# Altium project PI4.PrjPcb
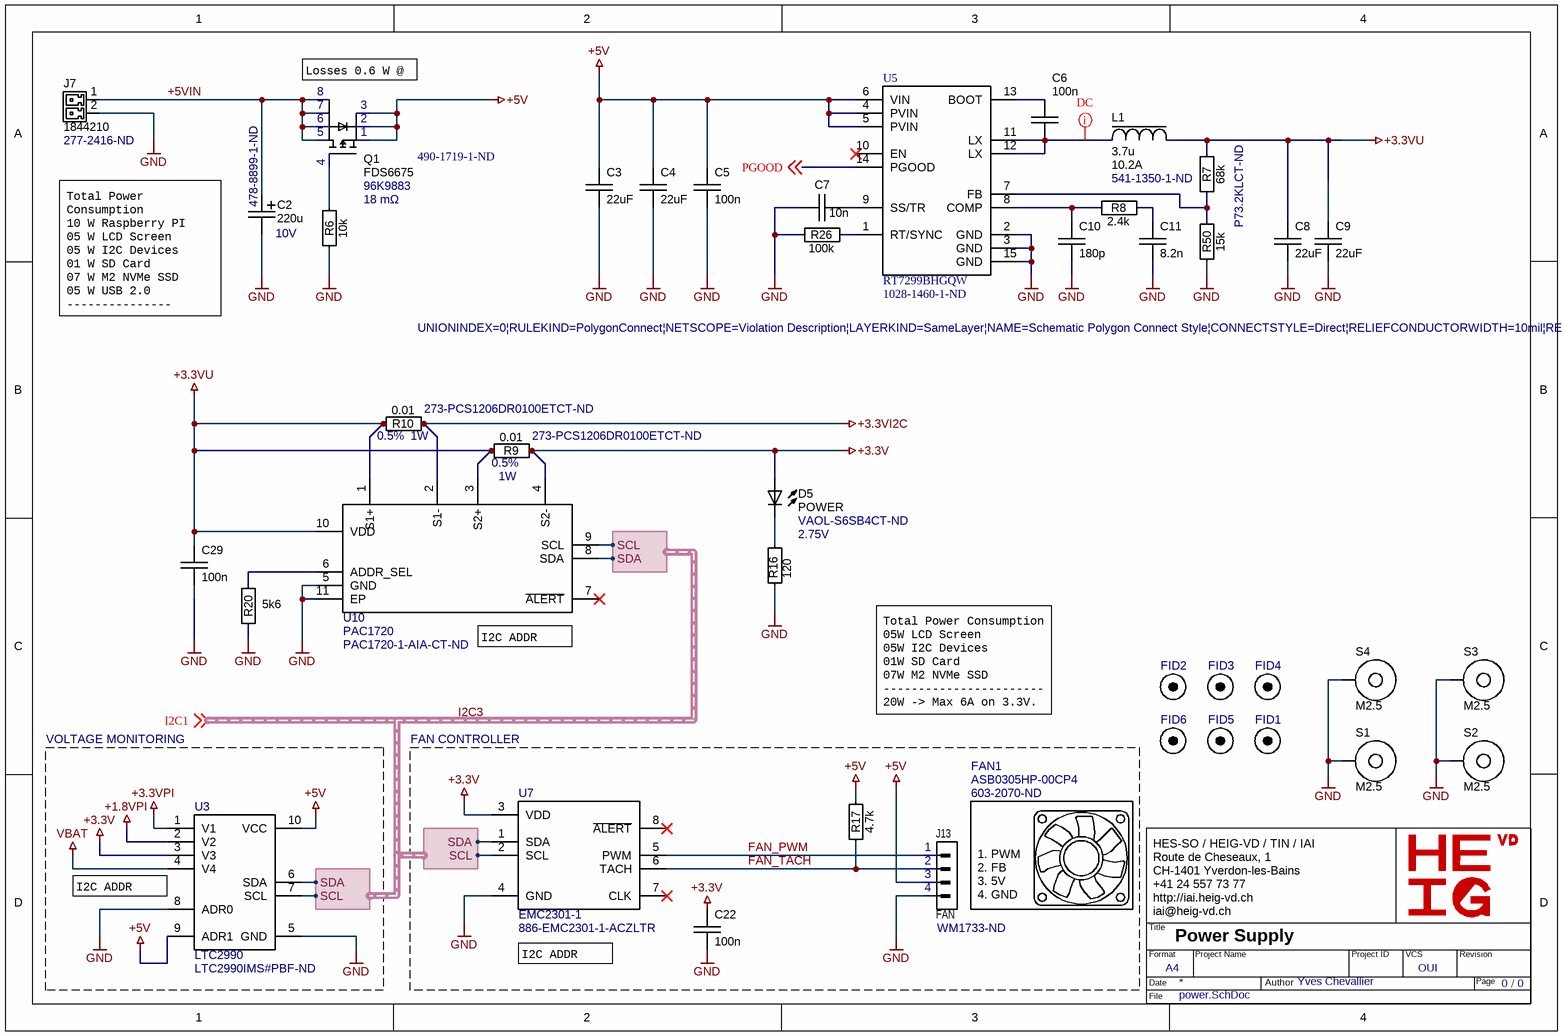
[diagram p0: power.SchDoc]
ProjectAuthor: Yves Chevallier; ProjectiAiTitle: RBT-CM4; ProjectNumber: 1541121; ProjectVersion: 0.1.0
5 sheets, 152 parts. Net scope: global (net labels, ports and power ports of the same name join across sheets).
Board file: pi4.PcbDoc
Sheets:
  power.SchDoc
  gpio.SchDoc
  i2c-can-lin.SchDoc
  usb.SchDoc
  audio.SchDoc

## Sheet power.SchDoc: Power Supply
size A4; ApprovedBy: Yves Chevallier; CheckedBy: Yves Chevallier; Author: Yves Chevallier; CompanyName: EPFL; DrawnBy: Yves Chevallier; Engineer: Yves Chevallier; Organization: EPFL; Address1: EPFL; Address2: CH1015 Lausanne; Address3: +41(0)21 693 36 98; Address4: +41(0)21 693 26 00; DocumentNumber: ABC.00.0000.000.0; Revision: v1.0; SheetNumber: 0; SheetTotal: 0; DrawnByDate: 2000-01-01; ExecutionWarrantDate: 2000-01-01; ExecutionWarrant: Yves Chevallier; Context: Confidential; PageSetup: Record=PageOptions|CenterHorizontal=True|CenterVertical=False|PrintScale=0.97|XCorrection=1.00|YCorrection=1.00|PrintKind=0|BorderSize=5000000|LeftOffset=0|BottomOffset=0|Orientation=2|PaperLength=1000|PaperWidth=1000|Scale=100|PaperSource=262|PrintQuality=600|MediaType=1|DitherType=10|PaperKind=A4|PrintScaleMode=1; EngineerDate: 2000-01-01; CheckedByDate: 2000-01-01; NoProject: 1541121; SVN: OUI; Version: 0.1.0; ProjectTitle: RBT-CM4; ProjectName: PRJ

### Parts
C2  220u  Supplier Part Number 1: 478-8899-1-ND  Voltage: 10V  [CAPPM6032X280N]
C3  22uF  Rule: UNIONINDEX=0|RULEKIND=PolygonConnect|NETSCOPE=Violation Description|LAYERKIND=SameLayer|NAME=Schematic Polygon Connect Style|CONNECTSTYLE=Direct|RELIEFCONDUCTORWIDTH=10mil|RELIEFENTRIES=4|POLYGONRELIEFANGLE=45 Angle|AIRGAPWIDTH=10mil|UNIT=Imperial  Supplier Part Number 1: 490-1719-1-ND  [SM/C1210]
C4  22uF  [SM/C1210]
C5  100n  [SM/C0603]
C6  100n  [SM/C0603]
C7  10n  [SM/C0603]
C8  22uF  [SM/C1210]
C9  22uF  [SM/C1210]
C10  180p  [SM/C0603]
C11  8.2n  [SM/C0603]
C22  100n  [SM/C0603]
C29  100n  [SM/C0603]
D5  POWER  Supplier Part Number 1: VAOL-S6SB4CT-ND  Vf: 2.75V  [SM/LED0603]
FAN1  ASB0305HP-00CP4  Supplier Part Number 1: 603-2070-ND  (mechanical)
FID1  Fiducial 1.5 mm  [FIDUCIAL]  (value not drawn)  (no BOM)
FID2  Fiducial 1.5 mm  [FIDUCIAL]  (value not drawn)  (no BOM)
FID3  Fiducial 1.5 mm  [FIDUCIAL]  (value not drawn)  (no BOM)
FID4  Fiducial 1.5 mm  [FIDUCIAL]  (value not drawn)  (no BOM)
FID5  Fiducial 1.5 mm  [FIDUCIAL]  (value not drawn)  (no BOM)
FID6  Fiducial 1.5 mm  [FIDUCIAL]  (value not drawn)  (no BOM)
J7  1844210  Supplier Part Number 1: 277-2416-ND  [CONN2/PHOENIX/MC 1.5-2-G-3.5]
J13  FAN  [CONN4/MOLEX/1.25mm/53047-0410]
L1  3.7u  Isat: 10.2A  Supplier Part Number 1: 541-1350-1-ND  [IND_IHLP-3232DZ_VIS]
Q1  FDS6675  Supplier Part Number 1: 96K9883  Rdson: 18 mΩ  [SOIC8]
R6  10k  [SM/R0603]
R7  68k  Supplier Part Number 1: P73.2KLCT-ND  [SM/R0603]
R8  2.4k  [SM/R0603]
R9  0.01  Power: 1W  Precision: 0.5%  [SM/R1206]
R10  0.01  Power: 1W  Precision: 0.5%  [SM/R1206]
R16  120  [SM/R0603]
R17  4.7k  [SM/R0603]
R20  5k6  [SM/R0603]
R26  100k  [SM/R0603]
R50  15k  [SM/R0603]
S1  M2.5  [HW/HOLE/M2.5]  (no BOM)
S2  M2.5  [HW/HOLE/M2.5]  (no BOM)
S3  M2.5  [HW/HOLE/M2.5]  (no BOM)
S4  M2.5  [HW/HOLE/M2.5]  (no BOM)
U3  LTC2990  Supplier Part Number 1: LTC2990IMS#PBF-ND  [MSOP10]
U5  RT7299BHGQW  Supplier Part Number 1: 1028-1460-1-ND  [RT7299B]
U7  EMC2301-1  Supplier Part Number 1: 886-EMC2301-1-ACZLTR  [MSOP8]
U10  PAC1720  Supplier Part Number 1: PAC1720-1-AIA-CT-ND  [DFN10_3x3MC_MCH-M]

### Blocks framed on the sheet
VOLTAGE MONITORING: U3
FAN CONTROLLER: C22 FAN1 J13 R17 U7

### Harnesses
I2C: SDA, SCL

### Nets
+1.8VPI: U3.2(V2)
+3.3V: C22.1 D5.1 R9.2 U3.3(V3) U7.3(VDD) U10.4(S2-)
+3.3VI2C: R10.2 U10.2(S1-)
+3.3VPI: U3.1(V1)
+3.3VU: C8.1 C9.1 C29.1 L1.1 R7.1 R9.1 R10.1 U10.1(S1+) U10.3(S2+) U10.10(VDD)
+5V: C3.1 C4.1 C5.1 J13.3 Q1.1(S) Q1.2(S) Q1.3(S) R17.2 U3.9(ADR1) U3.10(VCC) U5.4(PVIN) U5.5(PVIN) U5.6(VIN)
GND: C2.2(-) C3.2 C4.2 C5.2 C7.1 C8.2 C9.2 C10.2 C11.2 C22.2 C29.2 J7.2 J13.4 R6.1 R16.2 R20.1 R26.2 R50.2 S1.1 S2.1 S3.1 S4.1 U3.5(GND) U3.8(ADR0) U5.2(GND) U5.3(GND) U5.15(GND) U7.4(GND) U10.5(GND) U10.11(EP)
VBAT: U3.4(V4)
+5VIN: C2.1(+) J7.1 Q1.5(D) Q1.6(D) Q1.7(D) Q1.8(D)
FAN_PWM: J13.1 U7.5(PWM)
FAN_TACH: J13.2 R17.1 U7.6(TACH)
I2C3.SCL: U3.7(SCL) U7.2(SCL) U10.9(SCL) ; harness I2C.SCL
I2C3.SDA: U3.6(SDA) U7.1(SDA) U10.8(SDA) ; harness I2C.SDA
PGOOD: U5.14(PGOOD) ; off-sheet PGOOD
NetC6_1: C6.1 U5.13(BOOT)
NetC6_2: C6.2 L1.2 U5.11(LX) U5.12(LX)
NetC7_2: C7.2 U5.9(SS/TR)
NetC10_1: C10.1 R8.2 U5.8(COMP)
NetC11_1: C11.1 R8.1
NetD5_2: D5.2 R16.1
NetQ1_4: Q1.4(G) R6.2
NetR7_2: R7.2 R50.1 U5.7(FB)
NetR20_2: R20.2 U10.6(ADDR_SEL)
NetR26_1: R26.1 U5.1(RT/SYNC)

Not connected (* = marked no-connect by the designer): U5 10(EN)*; U7 7(CLK)* 8(~{ALERT})*; U10 7(~{ALERT})*

### Layout directives
rule Polygon Connect Style [Style - Direct Connect]: NetC6_2

### Notes on the sheet
- (near Q1) Losses 0.6 W @ 6A
- (near C2) Total Power Consumption
  10 W Raspberry PI
  05 W LCD Screen
  05 W I2C Devices
  01 W SD Card
  07 W M2 NVMe SSD
  05 W USB 2.0
  ---------------
  30 W -> Max 6A on 5V.
- (near U10) I2C ADDR 0x2c
- Total Power Consumption
  05W LCD Screen
  05W I2C Devices
  01W SD Card
  07W M2 NVMe SSD
  -----------------------
  20W -> Max 6A on 3.3V.
- (near U3) I2C ADDR 0x4e
- (near U7) I2C ADDR 0x2e
- Labels drawn without touching a wire or pin: I2C1
- HES-SO / HEIG-VD / TIN / IAI
  Route de Cheseaux, 1
  CH-1401 Yverdon-les-Bains
  +41 24 557 73 77
  http://iai.heig-vd.ch
  iai@heig-vd.ch
- Title
- Format
- Date
- A4
- Project Name
- Author
- Project ID
- VCS
- Revision
- Page
- /
- File
- (in symbol FAN) 1. PWM; 2. FB; 3. 5V; 4. GND

### Library data of the parts
C2 = C+2312: CAP TANT 220UF 20% 10V 2312; Supplier 1: Digi-Key
C3 = C: CL32B226KPJVPNE; Supplier 1: Digi-Key
C4 C8 C9 = C: CL32B226KPJVPNE; Rule: UNIONINDEX=0|RULEKIND=PolygonConnect|NETSCOPE=Violation Description|LAYERKIND=SameLayer|NAME=Schematic Polygon Connect Style|CONNECTSTYLE=Direct|RELIEFCONDUCTORWIDTH=10mil|RELIEFENTRIES=4|POLYGONRELIEFANGLE=45 Angle|AIRGAPWIDTH=10mil|UNIT=Imperial; Supplier 1: Digi-Key; Supplier Part Number 1: 490-1719-1-ND
C5 C7 C10 C11 = C: Chip Capacitor; Voltage: 16V; Dielectric: X7R; Rule: UNIONINDEX=0|RULEKIND=PolygonConnect|NETSCOPE=Violation Description|LAYERKIND=SameLayer|NAME=Schematic Polygon Connect Style|CONNECTSTYLE=Direct|RELIEFCONDUCTORWIDTH=10mil|RELIEFENTRIES=4|POLYGONRELIEFANGLE=45 Angle|AIRGAPWIDTH=10mil|UNIT=Imperial; Supplier 1: Digi-Key; Supplier Part Number 1: 490-13243-1-ND; Supplier 2 Part Number: 1292-1393-1-ND; Supplier 2: Digi-Key
C6 C22 C29 = C: Chip Capacitor; Voltage: 16V; Dielectric: X7R; Supplier 2 Part Number: 1292-1393-1-ND; Supplier 2: Digi-Key
D5 = LED: Supplier 1: Digi-Key
FAN1 = FAN: Supplier 1: Digi-Key
FID1-FID6 = FIDUCIAL
J7 = CONN 2 PHOENIX 3.5 mm: TERM BLOCK HDR 2POS 90DEG 3.5MM; Imax: 8A; Supplier 1: Digi-Key
J13 = CONN 4 MALE: WM1733-ND; Supplier 1: Digi-Key; Supplier Part Number 1: WM1733-ND
L1 = L: IHLP3232DZER2R2M11; Value: 2.2uH; Rule: UNIONINDEX=0|RULEKIND=PolygonConnect|NETSCOPE=Violation Description|LAYERKIND=SameLayer|NAME=Schematic Polygon Connect Style|CONNECTSTYLE=Direct|RELIEFCONDUCTORWIDTH=10mil|RELIEFENTRIES=4|POLYGONRELIEFANGLE=45 Angle|AIRGAPWIDTH=10mil|UNIT=Imperial; Supplier 1: Digi-Key
Q1 = NDS9435A: MOSFET P-CH 30V 11A 8SOIC; Supplier 1: Newark
R6 R8 R16 R17 R20 R26 R50 = R: Chip Resistor SMD
R7 = R: RES 73.2 KOHMS 0.1% 0.15W 0603; Supplier 1: Digi-Key
R9 R10 = R: 273-PCS1206DR0100ETCT-ND; Rule: UNIONINDEX=0|RULEKIND=PolygonConnect|NETSCOPE=Violation Description|LAYERKIND=SameLayer|NAME=Schematic Polygon Connect Style|CONNECTSTYLE=Direct|RELIEFCONDUCTORWIDTH=10mil|RELIEFENTRIES=4|POLYGONRELIEFANGLE=45 Angle|AIRGAPWIDTH=10mil|UNIT=Imperial; Supplier 1: Digi-Key; Supplier Part Number 1: 273-PCS1206DR0100ETCT-ND
S1-S4 = HOLE/M2.5
U5 = RT7299B: Buck Switching Regulator IC Positive Adjustable 0.6V 1 Output 8A 14-WFQFN Exposed Pad; Supplier 1: Digi-Key
U7 = EMC2301: IC MOTOR DRIVER 3V-3.6V 8MSOP; Supplier 1: Mouser
U10 = PAC1720: Stromüberwachung Regler Hohe Seite  10-DFN (3x3); Supplier 1: Digi-Key
U3 = LTC2990: Supplier 1: Digi-Key

## Sheet gpio.SchDoc: INTERFACES GPIO
size A4; ApprovedBy: Yves Chevallier; CheckedBy: Yves Chevallier; Author: Yves Chevallier; CompanyName: EPFL; DrawnBy: Yves Chevallier; Engineer: Yves Chevallier; Organization: EPFL; Address1: EPFL; Address2: CH1015 Lausanne; Address3: +41(0)21 693 36 98; Address4: +41(0)21 693 26 00; DocumentNumber: ABC.00.0000.000.0; Revision: v1.0; SheetNumber: 0; SheetTotal: 0; DrawnByDate: 2000-01-01; ExecutionWarrantDate: 2000-01-01; ExecutionWarrant: Yves Chevallier; Context: Confidential; PageSetup: Record=PageOptions|CenterHorizontal=True|CenterVertical=False|PrintScale=0.97|XCorrection=1.00|YCorrection=1.00|PrintKind=0|BorderSize=5000000|LeftOffset=0|BottomOffset=0|Orientation=2|PaperLength=1000|PaperWidth=1000|Scale=100|PaperSource=262|PrintQuality=600|MediaType=1|DitherType=10|PaperKind=A4|PrintScaleMode=1; EngineerDate: 2000-01-01; CheckedByDate: 2000-01-01; NoProject: 1541121; SVN: OUI; Version: 0.1.0; ProjectTitle: RBT-CM4; ProjectName: PRJ
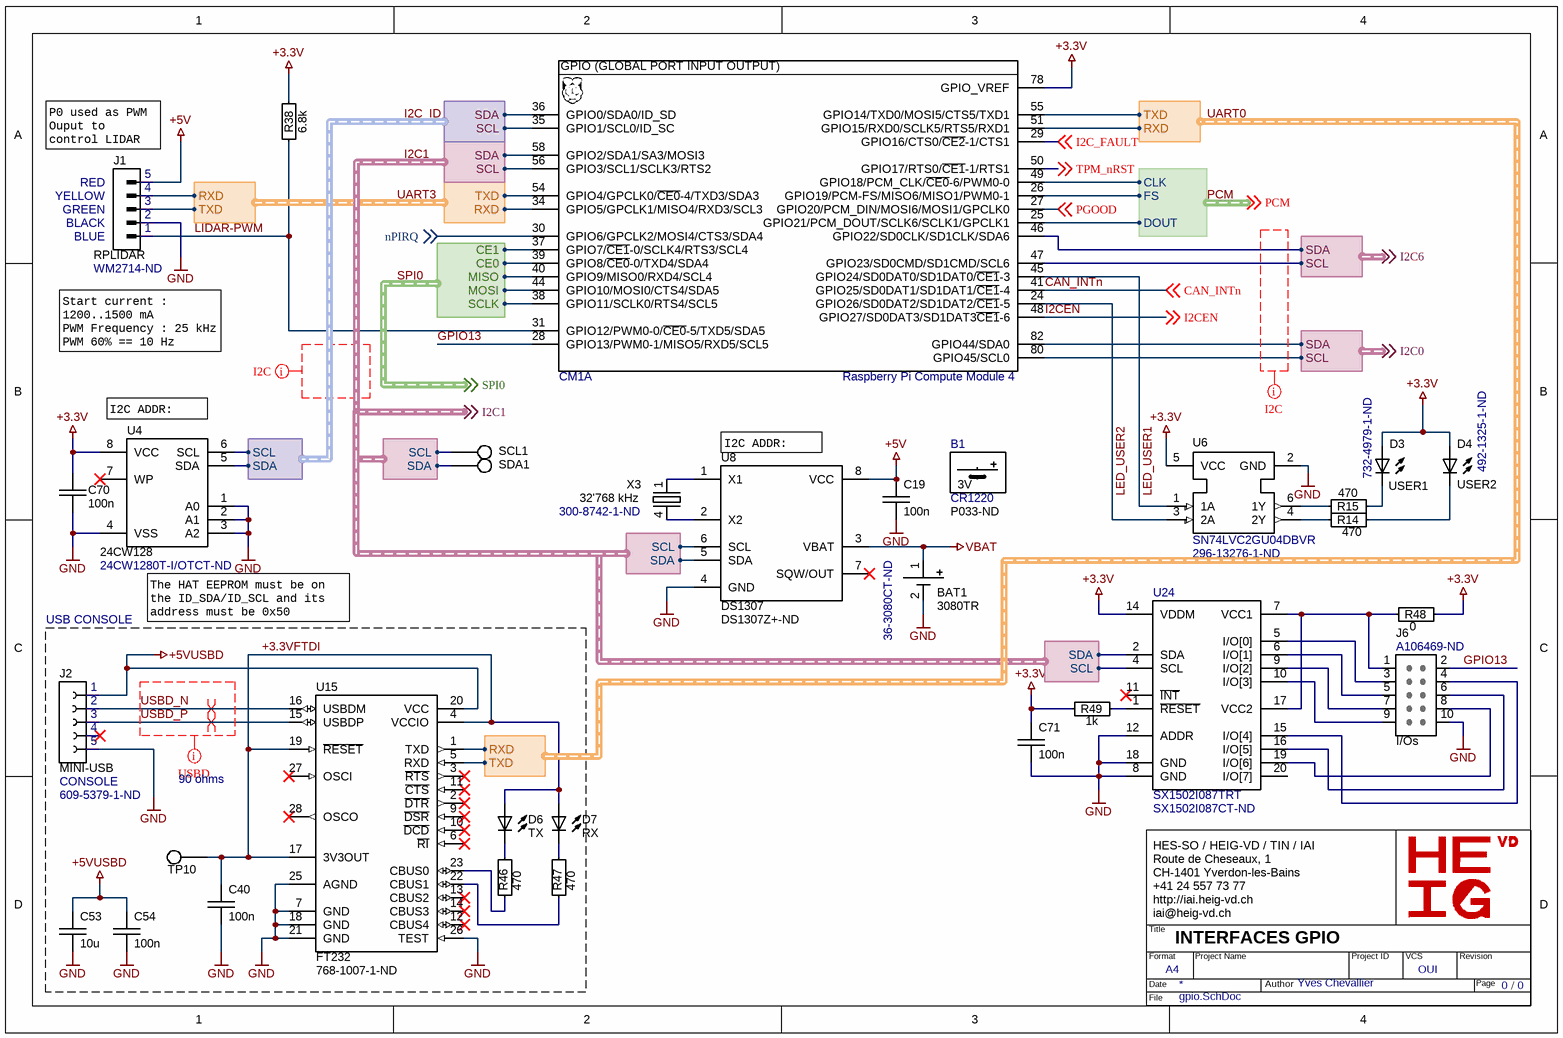
[diagram p1: gpio.SchDoc]

### Parts
(Parts that share a designator on the sheet are numbered #1, #2 ... from top to bottom, then left to right.)
B1  CR1220  Supplier Part Number 1: P033-ND  (mechanical)
BAT1  3080TR  Supplier Part Number 1: 36-3080CT-ND  [BAT_BK-916-TR]
C19  100n  [SM/C0603]
C40  100n  [SM/C0603]
C53  10u  [SM/C0805]
C54  100n  [SM/C0603]
C70  100n  [SM/C0603]
C71  100n  [SM/C0603]
CM1#1  Raspberry Pi Compute Module 4  [CM4-RASPBERRY-PI4]  (part A of 15)
D3  USER1  Supplier Part Number 1: 732-4979-1-ND  [SM/LED0603]
D4  USER2  Supplier Part Number 1: 492-1325-1-ND  [SM/LED0603]
D6  TX  [SM/LED0603]
D7  RX  [SM/LED0603]
J1  RPLIDAR  Supplier Part Number 1: WM2714-ND  [CONN/HEADER/2.54mm/5POS/MOLEX/22122054]
J2  MINI-USB  FUNCTION: CONSOLE  Supplier Part Number 1: 609-5379-1-ND  [AMPHENOL_10118192-0002LF]
J6  I/Os  Supplier Part Number 1: A106469-ND  [HE/2.54/10]
R14  470  [SM/R0603]
R15  470  [SM/R0603]
R38  6.8k  [SM/R0805]
R46  470  [SM/R0805]
R47  470  [SM/R0805]
R48  0  [SM/R0805]
R49  1k  [SM/R0805]
SCL1  TP  [TP/SMALL]  (value not drawn)  (no BOM)
SDA1  TP  [TP/SMALL]  (value not drawn)  (no BOM)
TP10  TP  [TP/SMALL]  (value not drawn)  (no BOM)
U4  24CW128  Supplier Part Number 1: 24CW1280T-I/OTCT-ND  [SOIC8]
U6  SN74LVC2GU04DBVR  Supplier Part Number 1: 296-13276-1-ND  [SOT23-6]
U8  DS1307  Supplier Part Number 1: DS1307Z+-ND  [SOIC8]
U15  FT232  Supplier Part Number 1: 768-1007-1-ND  [SSOP28]
U24  SX1502I087TRT  Supplier Part Number 1: SX1502I087CT-ND  [QFN40P300X300X50_HS-21N]
X3  32'768 kHz  Supplier Part Number 1: 300-8742-1-ND  [CRYSTAL/SMD/ABS25]

### Blocks framed on the sheet
USB CONSOLE: C40 C53 C54 D6 D7 J2 R46 R47 TP10 U15

### Harnesses
I2C: SDA, SCL
UART: TXD, RXD
SPI: CE1, MISO, MOSI, SCLK, CE0
PCM: CLK, FS, DOUT

### Nets
+3.3V: C70.1 C71.1 CM1#1.78(GPIO_VREF) D3.1 D4.1 R38.2 R48.2 R49.1 U4.8(VCC) U6.5(VCC) U24.14(VDDM)
+5V: C19.1 J1.5 U8.8(VCC)
+5VUSBD: C53.1 C54.1 J2.1 U15.20(VCC)
GND: BAT1.2(-) C19.2 C40.2 C53.2 C54.2 C70.2 C71.2 J1.2 J2.5 J6.10 U4.1(A0) U4.2(A1) U4.3(A2) U4.4(VSS) U6.2(GND) U8.4(GND) U15.7(GND) U15.18(GND) U15.21(GND) U15.25(AGND) U15.26(TEST) U24.8(GND) U24.12(ADDR) U24.18(GND)
VBAT: BAT1.1(+) U8.3(VBAT)
+3.3VFTDI: C40.1 D6.1 D7.1 TP10.1 U15.4(VCCIO) U15.17(3V3OUT) U15.19(~{RESET})
CAN_INTn: CM1#1.41(GPIO25/SD0DAT1/SD1DAT1/~{CE1}-4) ; off-sheet CAN_INTn
GPIO13: CM1#1.28(GPIO13/PWM0-1/MISO5/RXD5/SCL5) J6.2
I2C1.SCL: CM1#1.56(GPIO3/SCL1/SCLK3/RTS2) SCL1.1 U8.6(SCL) U24.4(SCL) ; harness I2C.SCL
I2C1.SDA: CM1#1.58(GPIO2/SDA1/SA3/MOSI3) SDA1.1 U8.5(SDA) U24.2(SDA) ; harness I2C.SDA
I2C_FAULT: CM1#1.29(GPIO16/CTS0/~{CE2}-1/CTS1) ; off-sheet I2C_FAULT
I2C_ID.SCL: CM1#1.35(GPIO1/SCL0/ID_SC) U4.6(SCL) ; harness I2C.SCL
I2C_ID.SDA: CM1#1.36(GPIO0/SDA0/ID_SD) U4.5(SDA) ; harness I2C.SDA
I2CEN: CM1#1.48(GPIO27/SD0DAT3/SD1DAT3~{CE1}-6) ; off-sheet I2CEN
LED_USER1: CM1#1.45(GPIO24/SD0DAT0/SD1DAT0/~{CE1}-3) U6.1(1A)
LED_USER2: CM1#1.24(GPIO26/SD0DAT2/SD1DAT2/~{CE1}-5) U6.3(2A)
LIDAR-PWM: CM1#1.31(GPIO12/PWM0-0/~{CE0}-5/TXD5/SDA5) J1.1 R38.1
nPIRQ: CM1#1.30(GPIO6/GPCLK2/MOSI4/CTS3/SDA4) ; off-sheet nPIRQ
PCM.CLK: CM1#1.49(GPIO18/PCM_CLK/~{CE0}-6/PWM0-0) ; harness PCM.CLK
PCM.DOUT: CM1#1.25(GPIO21/PCM_DOUT/SCLK6/SCLK1/GPCLK1) ; harness PCM.DOUT
PCM.FS: CM1#1.26(GPIO19/PCM-FS/MISO6/MISO1/PWM0-1) ; harness PCM.FS
PGOOD: CM1#1.27(GPIO20/PCM_DIN/MOSI6/MOSI1/GPCLK0) ; off-sheet PGOOD
SPI0.CE0: CM1#1.39(GPIO8/~{CE0}-0/TXD4/SDA4) ; harness SPI.CE0
SPI0.CE1: CM1#1.37(GPIO7/~{CE1}-0/SCLK4/RTS3/SCL4) ; harness SPI.CE1
SPI0.MISO: CM1#1.40(GPIO9/MISO0/RXD4/SCL4) ; harness SPI.MISO
SPI0.MOSI: CM1#1.44(GPIO10/MOSI0/CTS4/SDA5) ; harness SPI.MOSI
SPI0.SCLK: CM1#1.38(GPIO11/SCLK0/RTS4/SCL5) ; harness SPI.SCLK
TPM_nRST: CM1#1.50(GPIO17/RTS0/~{CE1}-1/RTS1) ; off-sheet TPM_nRST
UART0.RXD: CM1#1.51(GPIO15/RXD0/SCLK5/RTS5/RXD1) U15.1(TXD) ; harness UART.RXD
UART0.TXD: CM1#1.55(GPIO14/TXD0/MOSI5/CTS5/TXD1) U15.5(RXD) ; harness UART.TXD
UART3.RXD: CM1#1.34(GPIO5/GPCLK1/MISO4/RXD3/SCL3) J1.4 ; harness UART.RXD
UART3.TXD: CM1#1.54(GPIO4/GPCLK0/~{CE0}-4/TXD3/SDA3) J1.3 ; harness UART.TXD
USBD_N: J2.2 U15.16(USBDM)
USBD_P: J2.3 U15.15(USBDP)
NetCM1#1_46: CM1#1.46(GPIO22/SD0CLK/SD1CLK/SDA6) ; harness I2C.SDA
NetCM1#1_47: CM1#1.47(GPIO23/SD0CMD/SD1CMD/SCL6) ; harness I2C.SCL
NetCM1#1_80: CM1#1.80(GPIO45/SCL0) ; harness I2C.SCL
NetCM1#1_82: CM1#1.82(GPIO44/SDA0) ; harness I2C.SDA
NetD3_2: D3.2 R15.2
NetD4_2: D4.2 R14.2
NetD6_2: D6.2 R46.2
NetD7_2: D7.2 R47.2
NetJ6_1: J6.1 R48.1 U24.7(VCC1) U24.17(VCC2)
NetJ6_3: J6.3 U24.5(I/O[0])
NetJ6_4: J6.4 U24.15(I/O[4])
NetJ6_5: J6.5 U24.6(I/O[1])
NetJ6_6: J6.6 U24.16(I/O[5])
NetJ6_7: J6.7 U24.9(I/O[2])
NetJ6_8: J6.8 U24.19(I/O[6])
NetJ6_9: J6.9 U24.10(I/O[3])
NetR14_1: R14.1 U6.4(2Y)
NetR15_1: R15.1 U6.6(1Y)
NetR46_1: R46.1 U15.23(CBUS0)
NetR47_1: R47.1 U15.22(CBUS1)
NetR49_2: R49.2 U24.1(~{RESET})
NetU8_1: U8.1(X1) X3.1
NetU8_2: U8.2(X2) X3.4

Not connected (* = marked no-connect by the designer): J2 4*; U4 7(WP)*; U8 7(SQW/OUT)*; U15 2(~{DTR})* 3(~{RTS})* 6(~{RI})* 9(~{DSR})* 10(~{DCD})* 11(~{CTS})* 12(CBUS4)* 13(CBUS2)* 14(CBUS3)* 27(OSCI)* 28(OSCO)*; U24 11(~{INT})* 20(I/O[7])

### Layout directives
differential pair: USBD_N, USBD_P
rule Impedance Constraint [Min = 85.00    Max = 95.00    ]; Impedance: 90 ohms; rule Differential Pairs Routing [Pref Gap = 6.43mil    Min Gap  = 5.906mil    Max Gap  = 6.43milPref Width = 9.048mil    Min Width  = 5.906mil    Max Width  = 9.048mil]; rule Matched Net Lengths [Tolerance = 10mil]: USBD_N, USBD_P
net class I2C: (no net found under the mark)

### Notes on the sheet
- (near J1) P0 used as PWM Ouput to control LIDAR motor speed
- (near J1) RED
- (near J1) YELLOW
- (near J1) GREEN
- (near J1) BLACK
- (near J1) BLUE
- Start current : 1200..1500 mA
  PWM Frequency : 25 kHz
  PWM 60% == 10 Hz
- (near U4) I2C ADDR: 0x50
- (near U8) I2C ADDR: 0x68
- (near U4) The HAT EEPROM must be on the ID_SDA/ID_SCL and its address must be 0x50
- Labels drawn without touching a wire or pin: I2C0, I2C1, I2C6, PCM, SPI0
- HES-SO / HEIG-VD / TIN / IAI
  Route de Cheseaux, 1
  CH-1401 Yverdon-les-Bains
  +41 24 557 73 77
  http://iai.heig-vd.ch
  iai@heig-vd.ch
- Title
- Format
- Date
- A4
- Project Name
- Author
- Project ID
- VCS
- Revision
- Page
- /
- File
- (in symbol CM4, part A) GPIO (GLOBAL PORT INPUT OUTPUT)
- (in symbol CR1220) 3V

### Library data of the parts
B1 = CR1220: Lithum battery (LiCB) / 3V / 40mAh / 12.5 mm / 0.77 g; Supplier 1: Digi-Key
BAT1 = BAT: Supplier 1: Digi-Key
C19 C40 C54 C70 C71 = C: as C6 on sheet power; Supplier 2 Part Number: 1292-1393-1-ND; Supplier 2: Digi-Key
C53 = C: CAP CER 10UF 10V X5R 0805; Supplier 1: Digi-Key; Supplier Part Number 1: 1276-2402-1-ND
CM1#1 = CM4: Raspberry Pi Compute Module 4 by Amornthep Phunsin
D3 D4 D6 D7 = LED: Supplier 1: Digi-Key
  D6 D7: Supplier Part Number 1: 732-4979-1-ND
J1 = CONN 5 MALE: 0022122054; Supplier 1: Digi-Key
J2 = CONN 5 FEMALE: DEBUG; Supplier 1: Digi-Key
J6 = CONN 10 (2x5): Supplier 1: Digi-Key
R14 R15 R38 R46-R49 = R: Chip Resistor SMD
SCL1 SDA1 TP10 = TP: Test Point
U6 = SN74LVC2GU: IC INVERTER 2CH 2-INP SOT23-6; Supplier 1: Digi-Key
U8 = DS1307: RTC; Supplier 1: Digi-Key
U24 = SX1502I08: IC GPIO EXPANDER I2C 8CH 20QFNI/O Expander 8 I²C 400kHz 20-QFN-UT (3x3); Supplier 1: Digi-Key
X3 = XTAL: CM200C32768HZFT; Supplier 1: Digi-Key
U4 = 24CW128: Supplier 1: Digi-Key
U15 = FT232: Supplier 1: Digi-Key

## Sheet i2c-can-lin.SchDoc: CAN and I2C
size A4; Author: Yves Chevallier; Organization: Institut d'Automatisation Industrielle; NoProject: 1541121; SVN: OUI; Version: 0.1.0; ProjectTitle: RBT-CM4; ProjectName: <projet>
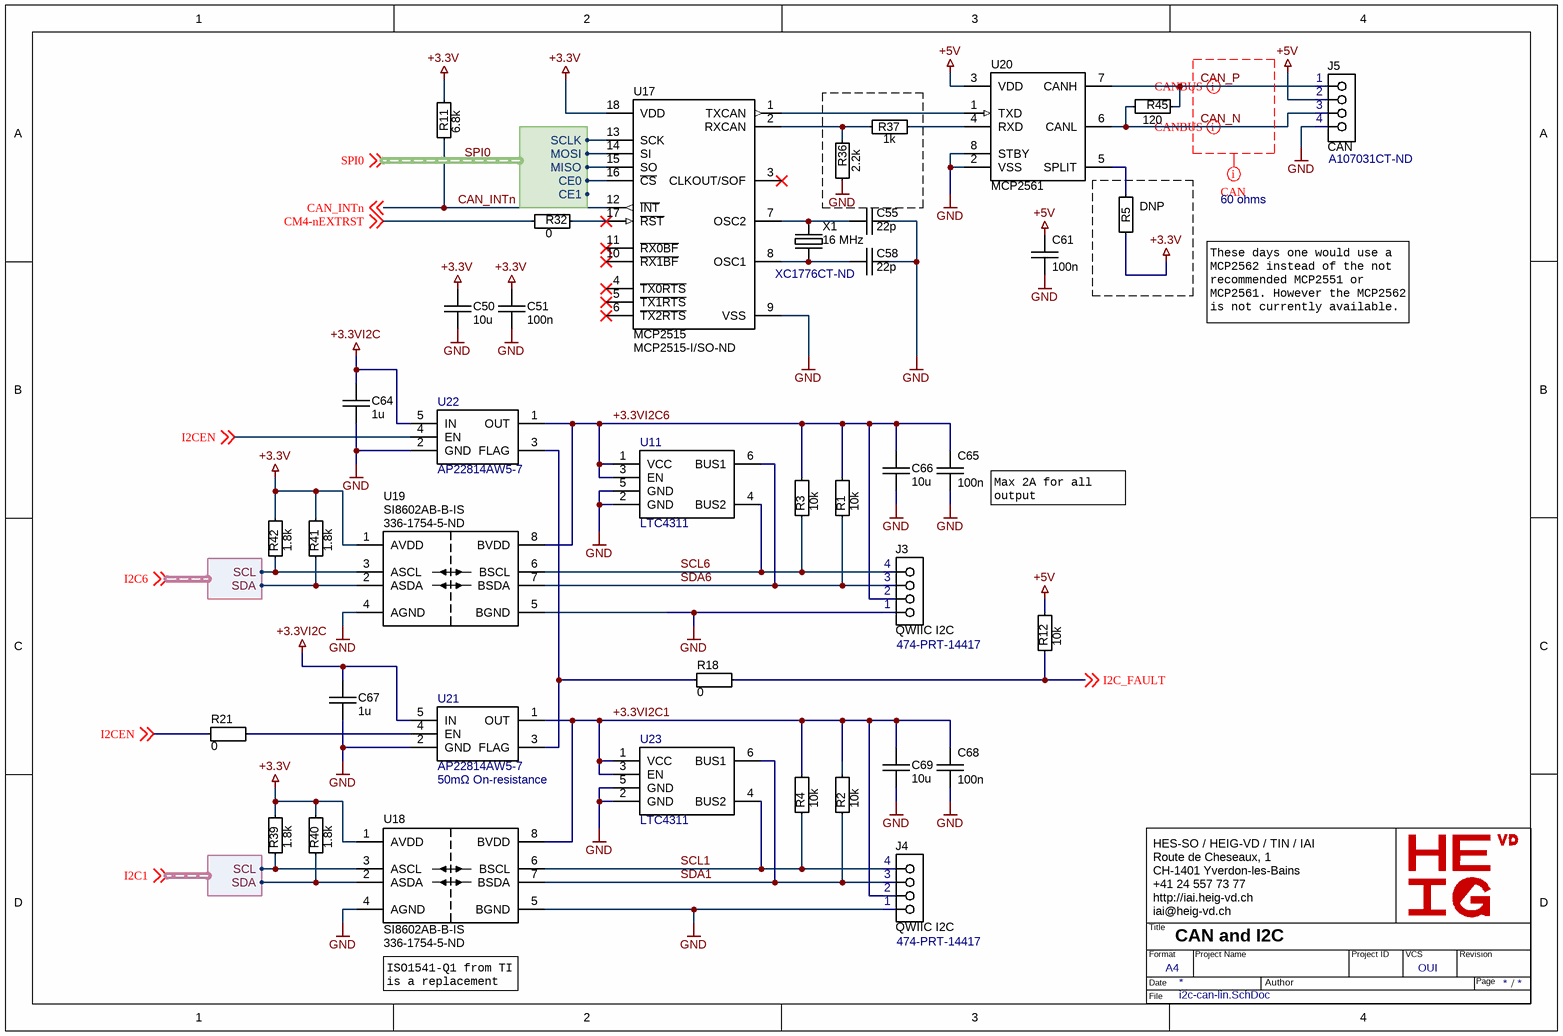
[diagram p2: i2c-can-lin.SchDoc]

### Parts
C50  10u  [SM/C0805]
C51  100n  [SM/C0603]
C55  22p  [SM/C0603]
C58  22p  [SM/C0603]
C61  100n  [SM/C0603]
C64  1u  [SM/C0603]
C65  100n  [SM/C0603]
C66  10u  [SM/C0805]
C67  1u  [SM/C0603]
C68  100n  [SM/C0603]
C69  10u  [SM/C0805]
J3  QWIIC I2C  Supplier Part Number 1: 474-PRT-14417  [QWIIC-SM04B-SRSS-TB]
J4  QWIIC I2C  Supplier Part Number 1: 474-PRT-14417  [QWIIC-SM04B-SRSS-TB]
J5  CAN  Supplier Part Number 1: A107031CT-ND  [TE/MICROMATCH/7-2178711-4]
R1  10k  [SM/R0603]
R2  10k  [SM/R0603]
R3  10k  [SM/R0603]
R4  10k  [SM/R0603]
R5  DNP  [SM/R0805]
R11  6.8k  [SM/R0805]
R12  10k  [SM/R0603]
R18  0  [SM/R0603]
R21  0  [SM/R0603]
R32  0  [SM/R0805]  (net tie)
R36  2.2k  [SM/R0805]
R37  1k  [SM/R0805]
R39  1.8k  [SM/R0603]
R40  1.8k  [SM/R0603]
R41  1.8k  [SM/R0603]
R42  1.8k  [SM/R0603]
R45  120  [SM/R0805]
U11  LTC4311  [SC70-6]
U17  MCP2515  Supplier Part Number 1: MCP2515-I/SO-ND  [SOIC18/MCP2515]
U18  SI8602AB-B-IS  Supplier Part Number 1: 336-1754-5-ND  [SOIC8]
U19  SI8602AB-B-IS  Supplier Part Number 1: 336-1754-5-ND  [SOIC8]
U20  MCP2561  [SOIC8]
U21  AP22814AW5-7  [SOT23-5]
U22  AP22814AW5-7  [SOT23-5]
U23  LTC4311  [SC70-6]
X1  16 MHz  Supplier Part Number 1: XC1776CT-ND  [XTAL-ECS-160-20-3X-TR]

### Harnesses
I2C: SDA, SCL
SPI: CE0, MISO, MOSI, SCLK, CE1

### Nets
+3.3V: C50.1 C51.1 R5.1 R11.2 R39.1 R40.1 R41.1 R42.1 U17.18(VDD) U18.1(AVDD) U19.1(AVDD)
+3.3VI2C: C64.1 C67.1 U21.5(IN) U22.5(IN)
+5V: C61.1 J5.2 R12.1 U20.3(VDD)
GND: C50.2 C51.2 C55.2 C58.2 C61.2 C64.2 C65.2 C66.2 C67.2 C68.2 C69.2 J3.1 J4.1 J5.4 R36.1 U11.2(GND) U11.5(GND) U17.9(VSS) U18.4(AGND) U18.5(BGND) U19.4(AGND) U19.5(BGND) U20.2(VSS) U20.8(STBY) U21.2(GND) U22.2(GND) U23.2(GND) U23.5(GND)
+3.3VI2C1: C68.1 C69.1 J4.2 R2.1 R4.1 U18.8(BVDD) U21.1(OUT) U23.1(VCC) U23.3(EN)
+3.3VI2C6: C65.1 C66.1 J3.2 R1.1 R3.1 U11.1(VCC) U11.3(EN) U19.8(BVDD) U22.1(OUT)
CAN_INTn: R11.1 U17.12(~{INT}) ; off-sheet CAN_INTn
CAN_N: J5.3 R45.1 U20.6(CANL)
CAN_P: J5.1 R45.2 U20.7(CANH)
CM4-nEXTRST: R32.2 ; off-sheet CM4-nEXTRST
I2C_FAULT: R12.2 R18.2 ; off-sheet I2C_FAULT
I2CEN: R21.1 U22.4(EN) ; off-sheet I2CEN
SCL1: J4.4 R4.2 U18.6(BSCL) U23.4(BUS2)
SCL6: J3.4 R3.2 U11.4(BUS2) U19.6(BSCL)
SDA1: J4.3 R2.2 U18.7(BSDA) U23.6(BUS1)
SDA6: J3.3 R1.2 U11.6(BUS1) U19.7(BSDA)
SPI0.CE0: U17.16(~{CS}) ; harness SPI.CE0
SPI0.MISO: U17.15(SO) ; harness SPI.MISO
SPI0.MOSI: U17.14(SI) ; harness SPI.MOSI
SPI0.SCLK: U17.13(SCK) ; harness SPI.SCLK
NetC55_1: C55.1 U17.7(OSC2) X1.2
NetC58_1: C58.1 U17.8(OSC1) X1.1
NetR5_2: R5.2 U20.5(SPLIT)
NetR18_1: R18.1 U21.3(FLAG) U22.3(FLAG)
NetR21_2: R21.2 U21.4(EN)
NetR32_1: R32.1 U17.17(~{RST})
NetR36_2: R36.2 R37.1 U17.2(RXCAN)
NetR37_2: R37.2 U20.4(RXD)
NetR39_2: R39.2 U18.3(ASCL) ; harness I2C.SCL
NetR40_2: R40.2 U18.2(ASDA) ; harness I2C.SDA
NetR41_2: R41.2 U19.2(ASDA) ; harness I2C.SDA
NetR42_2: R42.2 U19.3(ASCL) ; harness I2C.SCL
NetU17_1: U17.1(TXCAN) U20.1(TXD)

Not connected (* = marked no-connect by the designer): U17 3(CLKOUT/SOF)* 4(~{TX0RTS})* 5(~{TX1RTS})* 6(~{TX2RTS})* 10(~{RX1BF})* 11(~{RX0BF})*

### Layout directives
differential pair: CAN_N, CAN_P
rule Impedance Constraint [Min = 50.00    Max = 70.00    ]; Impedance: 60 ohms: CAN_N, CAN_P

### Notes on the sheet
- These days one would use a MCP2562 instead of the not recommended MCP2551 or MCP2561. However the MCP2562 is not currently available.
- (near C65) Max 2A for all output
- (near U21) 50mΩ On-resistance
- (near U18) ISO1541-Q1 from TI is a replacement for the SI8602AB
- Labels drawn without touching a wire or pin: I2C1, I2C6, SPI0
- HES-SO / HEIG-VD / TIN / IAI
  Route de Cheseaux, 1
  CH-1401 Yverdon-les-Bains
  +41 24 557 73 77
  http://iai.heig-vd.ch
  iai@heig-vd.ch
- Title
- Format
- Date
- A4
- Project Name
- Author
- Project ID
- VCS
- Revision
- Page
- /
- File

### Library data of the parts
C50 C55 C58 C66 C69 = C: Chip Capacitor
C51 C61 C64 C65 C67 C68 = C: as C6 on sheet power; Supplier 2 Part Number: 1292-1393-1-ND; Supplier 2: Digi-Key
J3-J5 = CONN 4
  J3 J4: Supplier 1: Mouser
  J5: Supplier 1: Digi-Key
R1-R5 R11 R12 R18 R21 R32 R36 R37 R39-R42 R45 = R: Chip Resistor SMD
U11 U23 = LTC4311: The LTC®4311 is a dual I2C active pull-up designed to / enhance data transmission speed and reliability for bus / loading conditions well beyond the 400pF I2C specifi cation / limit. The LTC4311 operates at supply voltages from 1.6V / to 5.5V and is also compatible with SMBus.
U18 U19 = SI8602AB-B-IS: Low-power dual channel digital isolator; Supplier 1: Digi-Key
U21 U22 = AP22804: Supplier 1: Digi-Key; Supplier Part Number 1: AP22814AW5-7DICT-ND
X1 = XTAL: Supplier 1: Digi-Key
U17 = MCP2515: Supplier 1: Digi-Key

## Sheet usb.SchDoc: USB
size A4; Author: Yves Chevallier; Organization: Institut d'Automatisation Industrielle; NoProject: 1541121; SVN: OUI; Version: 0.1.0; ProjectTitle: RBT-CM4; ProjectName: <projet>
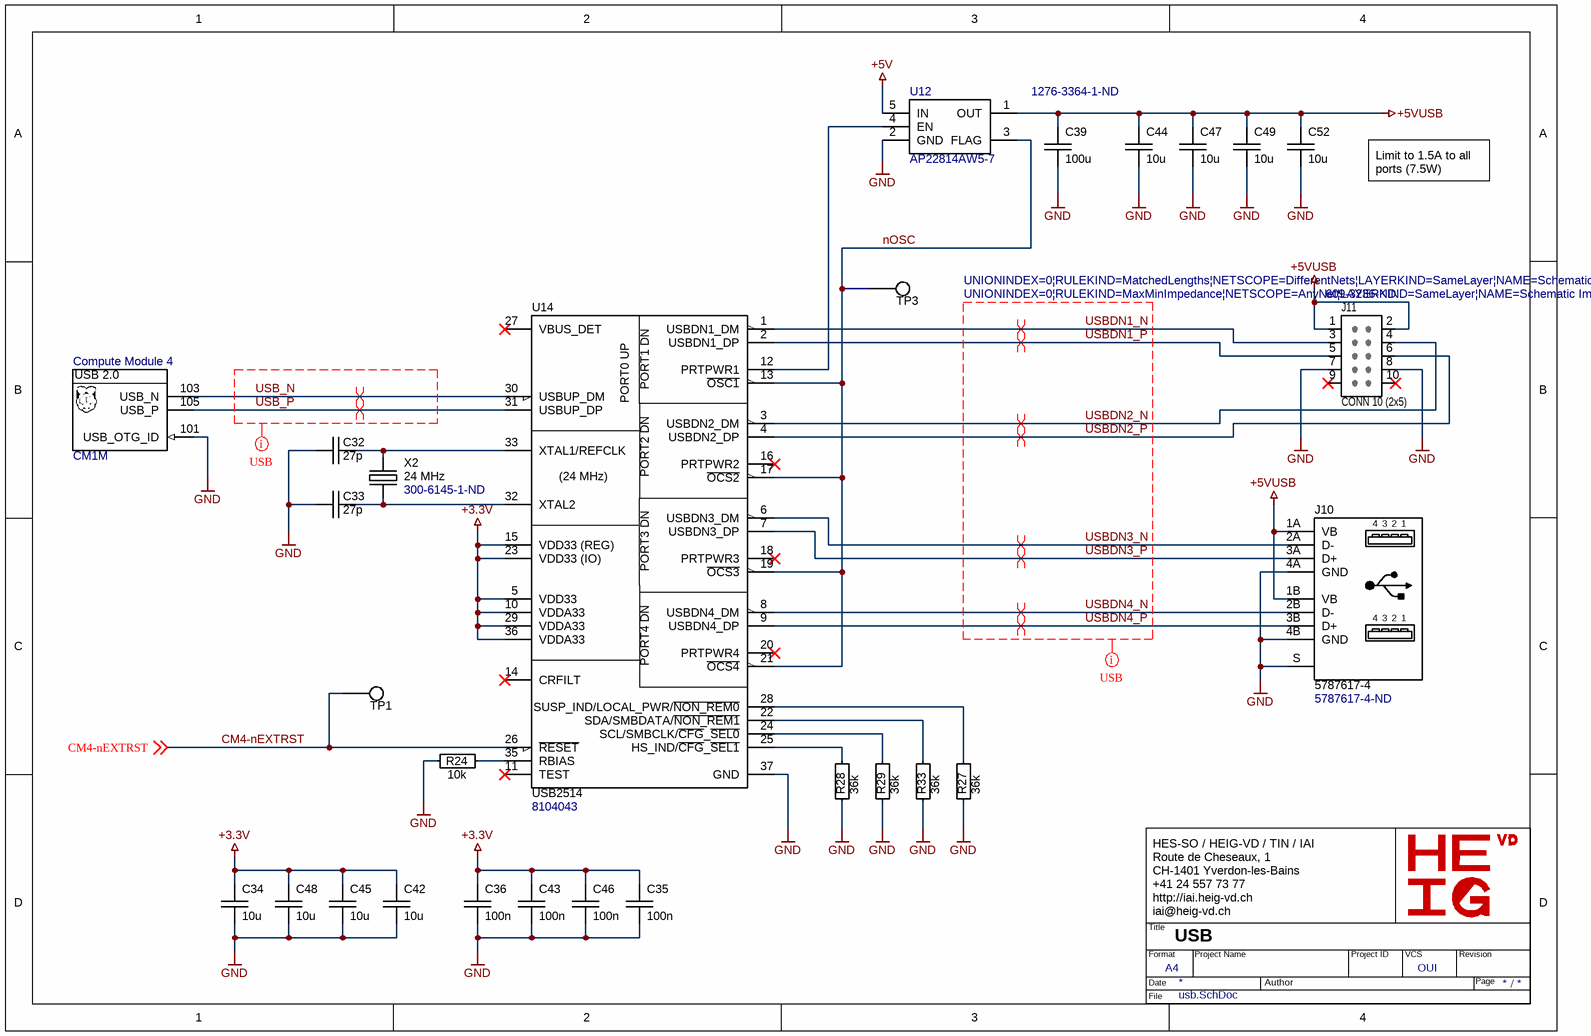
[diagram p3: usb.SchDoc]

### Parts
(Parts that share a designator on the sheet are numbered #1, #2 ... from top to bottom, then left to right.)
C32  27p  [SM/C0603]
C33  27p  [SM/C0603]
C34  10u  [SM/C0805]
C35  100n  [SM/C0603]
C36  100n  [SM/C0603]
C39  100u  Supplier Part Number 1: 1276-3364-1-ND  [SM/C1210]
C42  10u  [SM/C0805]
C43  100n  [SM/C0603]
C44  10u  [SM/C0805]
C45  10u  [SM/C0805]
C46  100n  [SM/C0603]
C47  10u  [SM/C0805]
C48  10u  [SM/C0805]
C49  10u  [SM/C0805]
C52  10u  [SM/C0805]
CM1#2  Compute Module 4  [CM4-RASPBERRY-PI4]  (part M of 16)
J10  5787617-4  Supplier Part Number 1: 5787617-4-ND  [TE/5787617-4]
J11  CONN 10 (2x5)  Supplier Part Number 1: 609-3236-ND  [HE/2.54/10]
R24  10k  [SM/R0805]
R27  36k  [SM/R0603]
R28  36k  [SM/R0603]
R29  36k  [SM/R0603]
R33  36k  [SM/R0603]
TP1  USB-nEXTRST  [TP/SMALL]  (value not drawn)  (no BOM)
TP3  USB-nEXTRST  [TP/SMALL]  (value not drawn)  (no BOM)
U12  AP22814AW5-7  [SOT23-5]
U14  USB2514  Supplier Part Number 1: 8104043  [QFN36_6X6_MCH]
X2  24 MHz  Supplier Part Number 1: 300-6145-1-ND  [XTAL-ECS-160-20-3X-TR]

### Nets
+3.3V: C34.1 C35.1 C36.1 C42.1 C43.1 C45.1 C46.1 C48.1 U14.5(VDD33) U14.10(VDDA33) U14.15(VDD33_(REG)) U14.23(VDD33_(IO)) U14.29(VDDA33) U14.36(VDDA33)
+5V: U12.5(IN)
+5VUSB: C39.1 C44.1 C47.1 C49.1 C52.1 J10.1A(VB) J10.1B(VB) J11.1 J11.2 U12.1(OUT)
GND: C32.2 C33.2 C34.2 C35.2 C36.2 C39.2 C42.2 C43.2 C44.2 C45.2 C46.2 C47.2 C48.2 C49.2 C52.2 CM1#2.101(USB_OTG_ID) J10.4A(GND) J10.4B(GND) J10.S(GND) J11.7 J11.8 R24.1 R27.1 R28.1 R29.1 R33.1 U12.2(GND) U14.37(GND)
CM4-nEXTRST: TP1.1 U14.26(~{RESET}) ; off-sheet CM4-nEXTRST
nOSC: TP3.1 U12.3(FLAG) U14.13(~{OSC1}) U14.17(~{OCS2}) U14.19(~{OCS3}) U14.21(~{OCS4})
USB_N: CM1#2.103(USB_N) U14.30(USBUP_DM)
USB_P: CM1#2.105(USB_P) U14.31(USBUP_DP)
USBDN1_N: J11.3 U14.1(USBDN1_DM)
USBDN1_P: J11.5 U14.2(USBDN1_DP)
USBDN2_N: J11.4 U14.3(USBDN2_DM)
USBDN2_P: J11.6 U14.4(USBDN2_DP)
USBDN3_N: J10.2A(D-) U14.6(USBDN3_DM)
USBDN3_P: J10.3A(D+) U14.7(USBDN3_DP)
USBDN4_N: J10.2B(D-) U14.8(USBDN4_DM)
USBDN4_P: J10.3B(D+) U14.9(USBDN4_DP)
NetC32_1: C32.1 U14.33(XTAL1/REFCLK) X2.2
NetC33_1: C33.1 U14.32(XTAL2) X2.1
NetR24_2: R24.2 U14.35(RBIAS)
NetR27_2: R27.2 U14.28(SUSP_IND/LOCAL_PWR/~{NON_REM0})
NetR28_2: R28.2 U14.25(HS_IND/~{CFG}_~{SEL1})
NetR29_2: R29.2 U14.24(SCL/SMBCLK/~{CFG}_~{SEL0})
NetR33_2: R33.2 U14.22(SDA/SMBDATA/~{NON_REM1})
NetU12_4: U12.4(EN) U14.12(PRTPWR1)

Not connected (* = marked no-connect by the designer): J11 9* 10*; U14 11(TEST)* 14(CRFILT)* 16(PRTPWR2)* 18(PRTPWR3)* 20(PRTPWR4)* 27(VBUS_DET)*

### Layout directives
differential pair: USB_N, USB_P
differential pair; differential pair class USB: USBDN1_N, USBDN1_P, USBDN2_N, USBDN2_P, USBDN3_N, USBDN3_P, USBDN4_N, USBDN4_P
rule Impedance Constraint [Min = 85.00    Max = 95.00    ]; rule Differential Pairs Routing [Pref Gap = 6.43mil    Min Gap  = 5.906mil    Max Gap  = 6.43milPref Width = 9.048mil    Min Width  = 5.906mil    Max Width  = 9.048mil]; rule Matched Net Lengths [Tolerance = 3mil]: USBDN1_N, USBDN1_P, USBDN2_N, USBDN2_P, USBDN3_N, USBDN3_P, USBDN4_N, USBDN4_P
rule Impedance Constraint [Min = 85.00    Max = 95.00    ]; rule Differential Pairs Routing [Pref Gap = 6.43mil    Min Gap  = 5.906mil    Max Gap  = 6.43milPref Width = 9.048mil    Min Width  = 5.906mil    Max Width  = 9.048mil]: USB_N, USB_P

### Notes on the sheet
- Limit to 1.5A to all ports (7.5W)
- HES-SO / HEIG-VD / TIN / IAI
  Route de Cheseaux, 1
  CH-1401 Yverdon-les-Bains
  +41 24 557 73 77
  http://iai.heig-vd.ch
  iai@heig-vd.ch
- Title
- Format
- Date
- A4
- Project Name
- Author
- Project ID
- VCS
- Revision
- Page
- /
- File
- (in symbol CM4, part M) USB 2.0
- (in symbol CONN/USB/2xA) 4; 3; 2; 1
- (in symbol USB2514B) PORT1 DN; PORT0 UP; PORT2 DN; (24 MHz); PORT3 DN; PORT4 DN

### Library data of the parts
C32 C33 C39 = C: Chip Capacitor
  C39: Supplier 1: Digi-Key
C34 C42 C44 C45 C47-C49 C52 = C: CAP CER 10UF 10V X5R 0805; Supplier 1: Digi-Key; Supplier Part Number 1: 1276-2402-1-ND
C35 C36 C43 C46 = C: as C6 on sheet power; Supplier 2 Part Number: 1292-1393-1-ND; Supplier 2: Digi-Key
CM1#2 = CM4: as CM1#1 on sheet gpio
J10 = CONN/USB/2xA: CONN RCPT USB 8POS STACK T/H; Supplier 1: Digi-Key
R24 R27-R29 R33 = R: Chip Resistor SMD
TP1 TP3 = TP: Test Point
U12 = AP22804: Supplier 1: Digi-Key; Supplier Part Number 1: AP22814AW5-7DICT-ND
U14 = USB2514B: USB2 HUB 4-PORT; Supplier 1: RSComponents
X2 = XTAL: HCM4924000000ABJT; Supplier 1: Digi-Key
J11 = CONN 10 (2x5): Supplier 1: Digi-Key

## Sheet audio.SchDoc: Audio speaker amplifier
size A4; Author: Yves Chevallier; Organization: Institut d'Automatisation Industrielle; NoProject: 1541121; SVN: OUI; Version: 0.1.0; ProjectTitle: RBT-CM4; ProjectName: <projet>
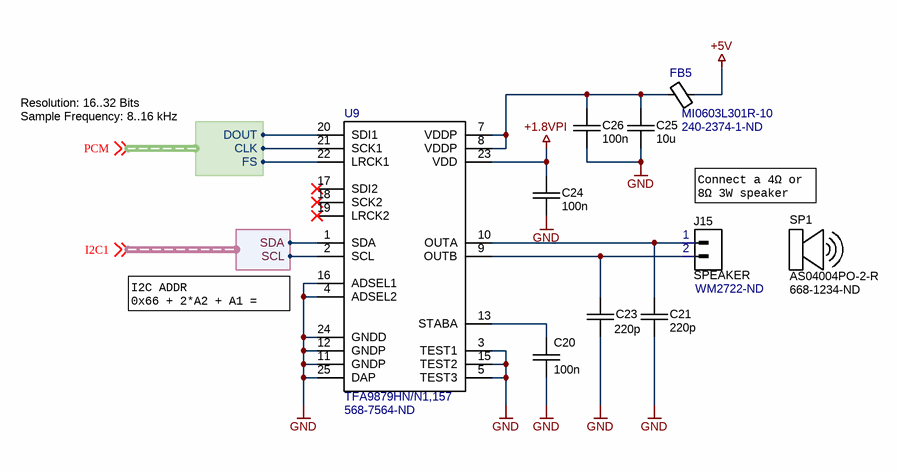
[diagram p4: audio.SchDoc]

### Parts
C20  100n  [SM/C0603]
C21  220p  [SM/C0603]
C23  220p  [SM/C0603]
C24  100n  [SM/C0603]
C25  10u  [SM/C0805]
C26  100n  [SM/C0603]
FB5  MI0603L301R-10  Supplier Part Number 1: 240-2374-1-ND  [SM/L0603]
J15  SPEAKER  Supplier Part Number 1: WM2722-ND  [CONN/HEADER/2.54mm/2POS]
SP1  AS04004PO-2-R  Supplier Part Number 1: 668-1234-ND  (mechanical)
U9  TFA9879HN/N1,157  Supplier Part Number 1: 568-7564-ND  [QFN50P260X260X100-25N]

### Harnesses
I2C: SDA, SCL
PCM: CLK, FS, DOUT

### Nets
+1.8VPI: C24.1 U9.23(VDD)
+5V: FB5.1
GND: C20.2 C21.2 C23.2 C24.2 C25.2 C26.2 U9.3(TEST1) U9.4(ADSEL2) U9.5(TEST3) U9.11(GNDP) U9.12(GNDP) U9.15(TEST2) U9.16(ADSEL1) U9.24(GNDD) U9.25(DAP)
NetC20_1: C20.1 U9.13(STABA)
NetC21_1: C21.1 J15.1 U9.10(OUTA)
NetC23_1: C23.1 J15.2 U9.9(OUTB)
NetC25_1: C25.1 C26.1 FB5.2 U9.7(VDDP) U9.8(VDDP)
NetU9_1: U9.1(SDA) ; harness I2C.SDA
NetU9_2: U9.2(SCL) ; harness I2C.SCL
NetU9_20: U9.20(SDI1) ; harness PCM.DOUT
NetU9_21: U9.21(SCK1) ; harness PCM.CLK
NetU9_22: U9.22(LRCK1) ; harness PCM.FS

Not connected (* = marked no-connect by the designer): U9 17(SDI2)* 18(SCK2)* 19(LRCK2)*

### Notes on the sheet
- Resolution: 16..32 Bits
  Sample Frequency: 8..16 kHz
- Connect a 4Ω or 8Ω 3W speaker
- I2C ADDR
  0x66 + 2*A2 + A1 = 0x6c
- Labels drawn without touching a wire or pin: I2C1, PCM
- HES-SO / HEIG-VD / TIN / IAI
  Route de Cheseaux, 1
  CH-1401 Yverdon-les-Bains
  +41 24 557 73 77
  http://iai.heig-vd.ch
  iai@heig-vd.ch
- Title
- Format
- Date
- A4
- Project Name
- Author
- Project ID
- VCS
- Revision
- Page
- /
- File

### Library data of the parts
C20 C21 C23 C24 C26 = C: as C6 on sheet power
  C20 C24 C26: Supplier 2 Part Number: 1292-1393-1-ND; Supplier 2: Digi-Key
C25 = C: CAP CER 10UF 10V X5R 0805; Supplier 1: Digi-Key; Supplier Part Number 1: 1276-2402-1-ND
FB5 = FB0603: Supplier 1: Digi-Key
J15 = CONN 2 MALE: Supplier 1: Digi-Key
SP1 = SPEAKER/3W: SPEAKER 4OHM 3W TOP PORT 82DB; Supplier 1: Digi-Key
U9 = TFA9879: IC AMP CLSS D MONO 2.75W 24HVQFN; Supplier 1: Digi-Key

## Nets that join several sheets
+1.8VPI: power (U3.2), audio (C24.1 U9.23)
+3.3V: power (6 pins), gpio (11 pins), i2c-can-lin (11 pins), usb (14 pins)
+3.3VI2C: power (R10.2 U10.2), i2c-can-lin (C64.1 C67.1 U21.5 U22.5)
+5V: power (13 pins), gpio (C19.1 J1.5 U8.8), i2c-can-lin (C61.1 J5.2 R12.1 U20.3), usb (U12.5), audio (FB5.1)
GND: power (30 pins), gpio (24 pins), i2c-can-lin (28 pins), usb (28 pins), audio (15 pins)
VBAT: power (U3.4), gpio (BAT1.1 U8.3)
CAN_INTn: gpio (CM1#1.41), i2c-can-lin (R11.1 U17.12)
CM4-nEXTRST: i2c-can-lin (R32.2), usb (TP1.1 U14.26)
I2C_FAULT: gpio (CM1#1.29), i2c-can-lin (R12.2 R18.2)
I2CEN: gpio (CM1#1.48), i2c-can-lin (R21.1 U22.4)
PGOOD: power (U5.14), gpio (CM1#1.27)
SPI0.CE0: gpio (CM1#1.39), i2c-can-lin (U17.16)
SPI0.MISO: gpio (CM1#1.40), i2c-can-lin (U17.15)
SPI0.MOSI: gpio (CM1#1.44), i2c-can-lin (U17.14)
SPI0.SCLK: gpio (CM1#1.38), i2c-can-lin (U17.13)